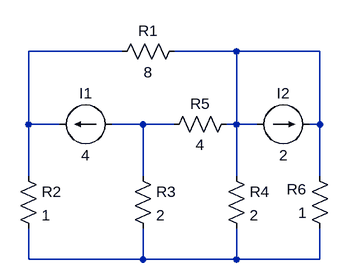
[diagram p0: schematic Draft25.asc]
Draft25.asc, the LTspice schematic file:
Version 4
SHEET 1 880 680
WIRE 128 0 -16 0
WIRE 304 0 208 0
WIRE 432 0 304 0
WIRE -16 112 -16 0
WIRE 32 112 -16 112
WIRE 160 112 112 112
WIRE 208 112 160 112
WIRE 304 112 304 0
WIRE 304 112 288 112
WIRE 336 112 304 112
WIRE 432 112 432 0
WIRE 432 112 416 112
WIRE -16 192 -16 112
WIRE 160 192 160 112
WIRE 304 192 304 112
WIRE 432 192 432 112
WIRE -16 320 -16 272
WIRE 160 320 160 272
WIRE 160 320 -16 320
WIRE 304 320 304 272
WIRE 304 320 160 320
WIRE 432 320 432 272
WIRE 432 320 304 320
SYMBOL res 224 -16 R90
WINDOW 0 0 56 VBottom 2
WINDOW 3 32 56 VTop 2
SYMATTR InstName R1
SYMATTR Value 8
SYMBOL current 112 112 R90
WINDOW 0 -32 40 VBottom 2
WINDOW 3 32 40 VTop 2
SYMATTR InstName I1
SYMATTR Value 4
SYMBOL res -32 176 R0
SYMATTR InstName R2
SYMATTR Value 1
SYMBOL res 144 176 R0
SYMATTR InstName R3
SYMATTR Value 2
SYMBOL res 288 176 R0
SYMATTR InstName R4
SYMATTR Value 2
SYMBOL res 304 96 R90
WINDOW 0 0 56 VBottom 2
WINDOW 3 32 56 VTop 2
SYMATTR InstName R5
SYMATTR Value 4
SYMBOL res 448 288 R180
WINDOW 0 36 76 Left 2
WINDOW 3 36 40 Left 2
SYMATTR InstName R6
SYMATTR Value 1
SYMBOL current 336 112 R270
WINDOW 0 32 40 VTop 2
WINDOW 3 -32 40 VBottom 2
SYMATTR InstName I2
SYMATTR Value 2

The netlist it stands for:
* Draft25.asc
R1 N002 N001 8
I1 N003 N001 4
R2 N001 N004 1
R3 N003 N004 2
R4 N002 N004 2
R5 N002 N003 4
R6 N004 N002 1
I2 N002 N002 2
.backanno
.end